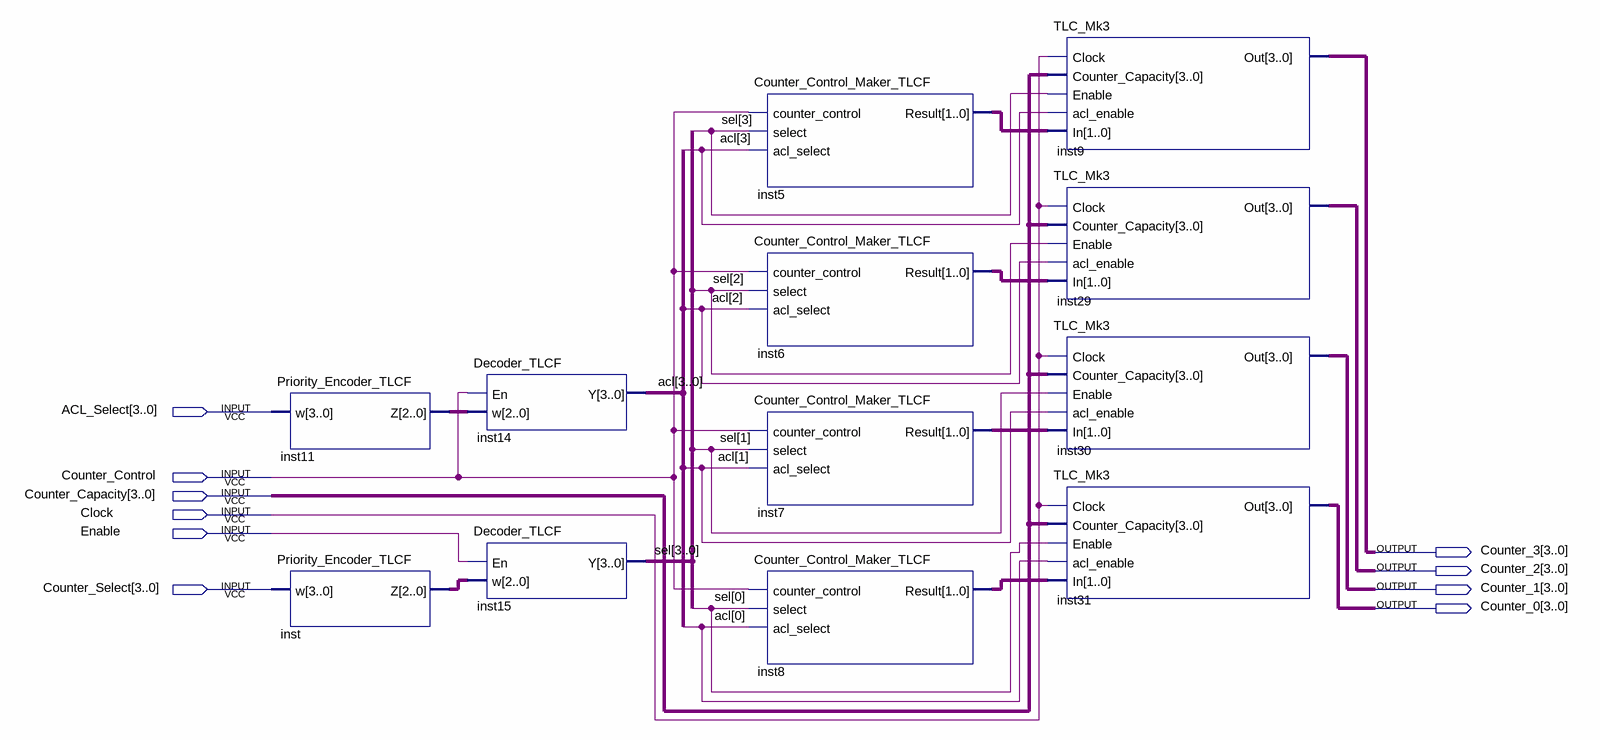
[diagram p0: schematic sheet]
// Quartus schematic TLCF.bdf as structural Verilog: 12 symbols, 10 pins
module TLCF (
  input  [3:0] ACL_Select,
  input  Counter_Control,
  input  [3:0] Counter_Capacity,
  input  Clock,
  input  Enable,
  input  [3:0] Counter_Select,
  output [3:0] Counter_3,
  output [3:0] Counter_2,
  output [3:0] Counter_1,
  output [3:0] Counter_0
);

  wire [1:0] inst5_result, inst6_result, inst7_result, inst8_result;
  wire [2:0] inst11_z, inst_z;
  wire [3:0] acl, sel;

  Priority_Encoder_TLCF inst11 (.w(ACL_Select), .Z(inst11_z));
  Priority_Encoder_TLCF inst (.w(Counter_Select), .Z(inst_z));
  Decoder_TLCF inst14 (.En(Counter_Control), .w(inst11_z), .Y(acl));
  Decoder_TLCF inst15 (.En(Enable), .w(inst_z), .Y(sel));
  Counter_Control_Maker_TLCF inst5 (
    .counter_control(Counter_Control), .select(sel[3]), .acl_select(acl[3]), .Result(inst5_result));
  Counter_Control_Maker_TLCF inst6 (
    .counter_control(Counter_Control), .select(sel[2]), .acl_select(acl[2]), .Result(inst6_result));
  Counter_Control_Maker_TLCF inst7 (
    .counter_control(Counter_Control), .select(sel[1]), .acl_select(acl[1]), .Result(inst7_result));
  Counter_Control_Maker_TLCF inst8 (
    .counter_control(Counter_Control), .select(sel[0]), .acl_select(acl[0]), .Result(inst8_result));
  TLC_Mk3 inst9 (
    .Clock(Clock), .Counter_Capacity(Counter_Capacity), .Enable(sel[3]), .acl_enable(acl[3]),
    .In(inst5_result), .Out(Counter_3));
  TLC_Mk3 inst29 (
    .Clock(Clock), .Counter_Capacity(Counter_Capacity), .Enable(sel[2]), .acl_enable(acl[2]),
    .In(inst6_result), .Out(Counter_2));
  TLC_Mk3 inst30 (
    .Clock(Clock), .Counter_Capacity(Counter_Capacity), .Enable(sel[1]), .acl_enable(acl[1]),
    .In(inst7_result), .Out(Counter_1));
  TLC_Mk3 inst31 (
    .Clock(Clock), .Counter_Capacity(Counter_Capacity), .Enable(sel[0]), .acl_enable(acl[0]),
    .In(inst8_result), .Out(Counter_0));
endmodule
